# EAGLE design Adafruit S-35710 Breakout (EAGLE 9.6.2)
COMPANY: ADAFRUIT INDUSTRIES; DRAWN: KTOWN; REV: A
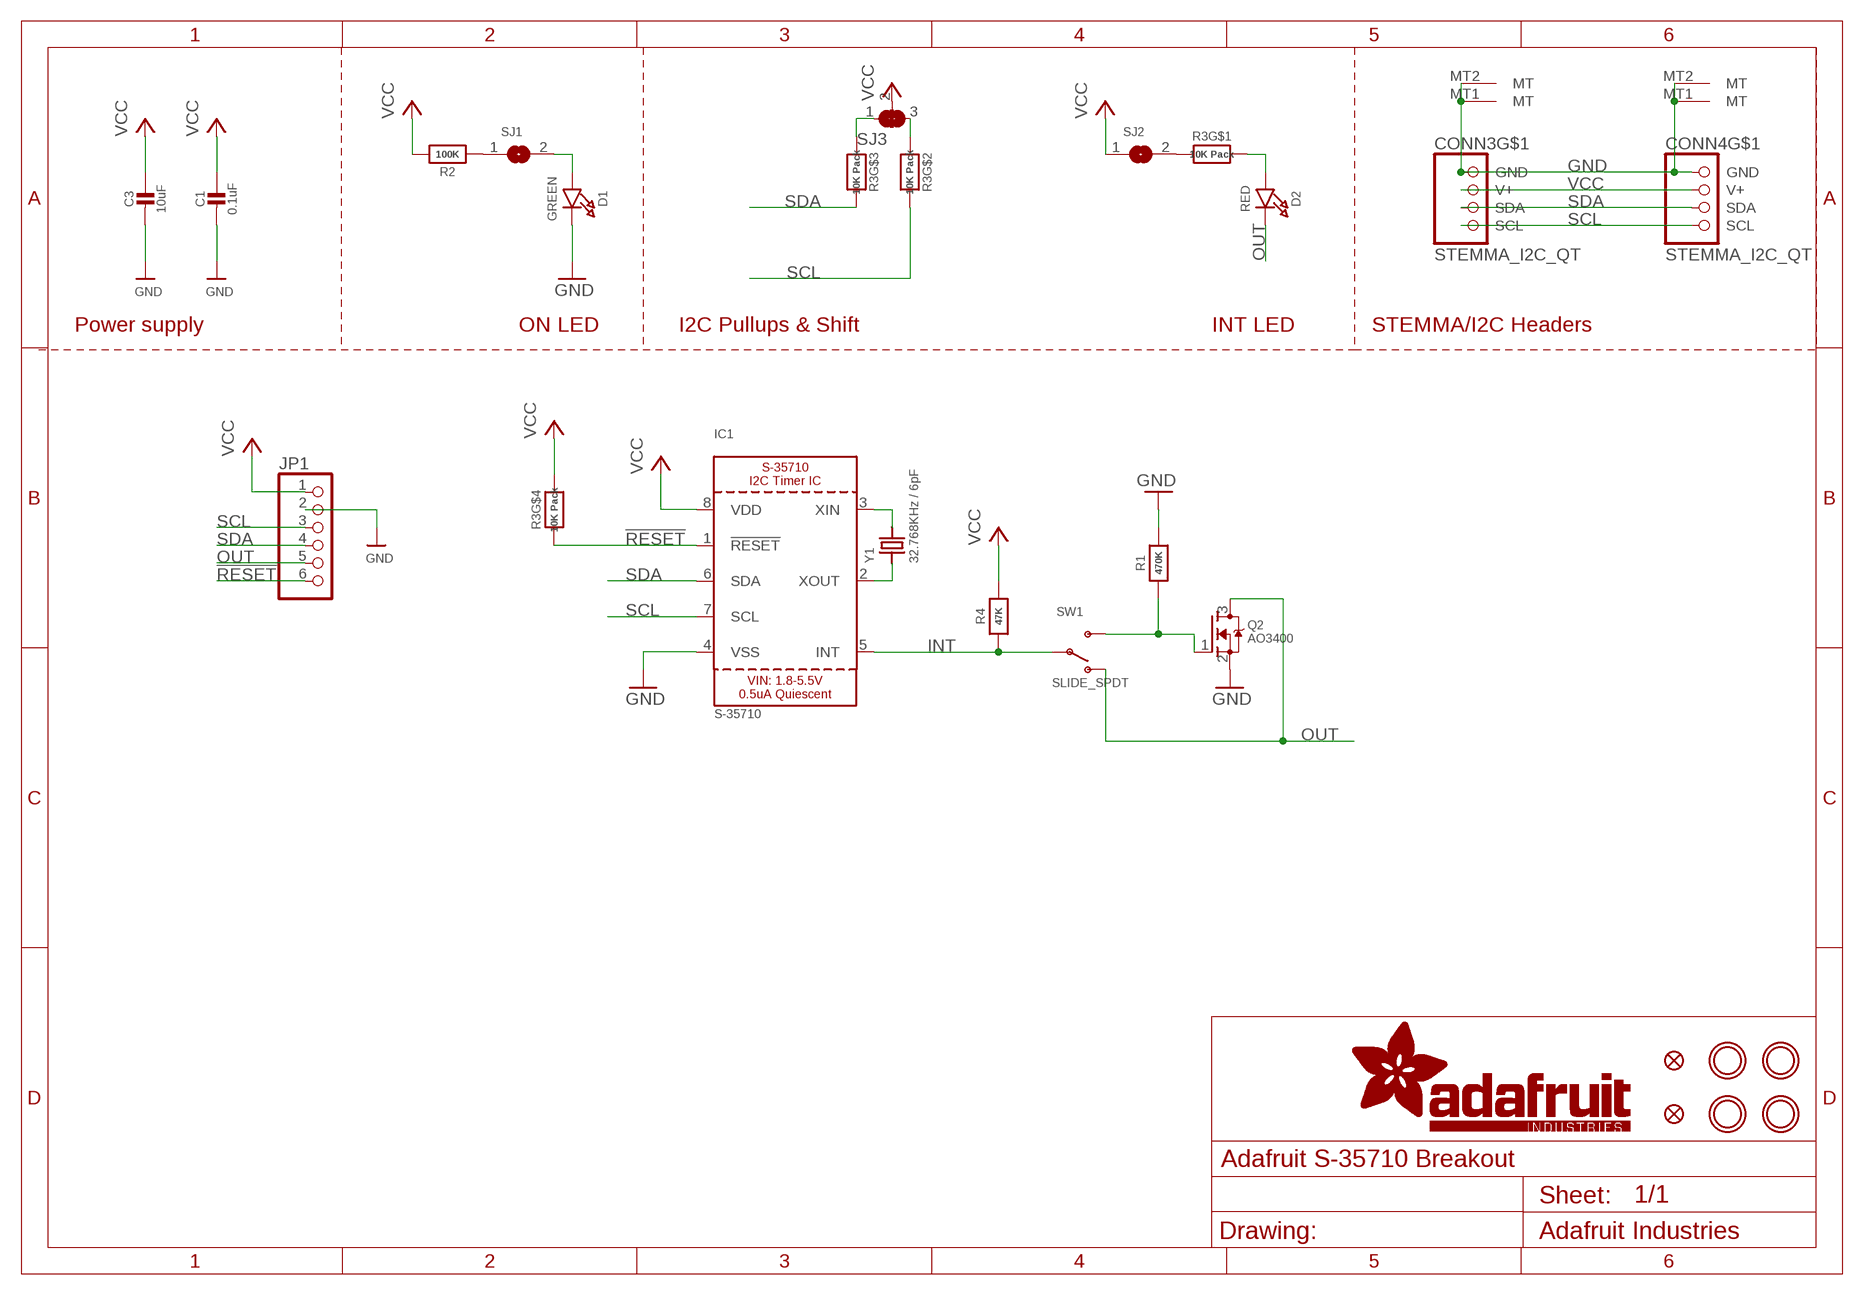
[diagram p0: schematic, sheet 1]

## Parts
C1  0.1uF  CAP_CERAMIC0603_NO  [0603-NO]
C3  10uF  CAP_CERAMIC0805-NOOUTLINE  [0805-NO]
CONN3  STEMMA_I2C_QT  [JST_SH4]
CONN4  STEMMA_I2C_QT  [JST_SH4]
D1  GREEN  LED0603_NOOUTLINE  [CHIPLED_0603_NOOUTLINE]
D2  RED  LED0603_NOOUTLINE  [CHIPLED_0603_NOOUTLINE]
FID3  FIDUCIAL_1MM  [FIDUCIAL_1MM]
FID4  FIDUCIAL_1MM  [FIDUCIAL_1MM]
IC1  S-35710  [MSOP8_0.65MM]
JP1  HEADER-1X670MIL  [1X06_ROUND_70]
Q2  AO3400  MOSFET-NWIDE  [SOT23-WIDE]
R1  470K  RESISTOR_0603_NOOUT  [0603-NO]
R2  100K  RESISTOR_0603_NOOUT  [0603-NO]
R3  10K Pack  RESISTOR_4PACK  [RESPACK_4X0603]
R4  47K  RESISTOR_0603_NOOUT  [0603-NO]
SJ1  SOLDERJUMPERCLOSED  [SOLDERJUMPER_CLOSEDWIRE]
SJ2  SOLDERJUMPERCLOSED  [SOLDERJUMPER_CLOSEDWIRE]
SJ3  SOLDERJUMPER_2WAY  [SOLDERJUMPER_2WAY_OPEN_NOPASTE]
SW1  SLIDE_SPDT  SWITCH_SPDT  [SPDT_SMT_SSSS811101]
U$1  MOUNTINGHOLE2.5  [MOUNTINGHOLE_2.5_PLATED]
U$17  MOUNTINGHOLE2.5  [MOUNTINGHOLE_2.5_PLATED]
U$19  MOUNTINGHOLE2.5  [MOUNTINGHOLE_2.5_PLATED]
U$21  MOUNTINGHOLE2.5  [MOUNTINGHOLE_2.5_PLATED]
Y1  32.768KHz / 6pF  CRYSTAL_3215  [XTAL3215]

## Nets
!RESET: IC1.1(!RESET) JP1.6 R3.4
GND [highpower]: C1.2 C3.2 CONN3.1(GND) CONN3.MT1(MT) CONN3.MT2(MT) CONN4.1(GND) CONN4.MT1(MT) CONN4.MT2(MT) D1.C IC1.4(VSS) JP1.2 Q2.2(S) R1.2
INT: IC1.5(INT) R4.1 SW1.B(P)
N$1: D1.A SJ1.2
N$2: R3.1 SJ2.2
N$3: R2.1 SJ1.1
N$4: D2.A R3.8
N$5: IC1.3(XIN) Y1.P$2
N$6: IC1.2(XOUT) Y1.P$1
N$7: R3.3 SJ3.1
N$8: Q2.1(G) R1.1 SW1.C(S)
N$9: R3.2 SJ3.3
OUT: D2.C JP1.5 Q2.3(D) SW1.A(O)
SCL: CONN3.4(SCL) CONN4.4(SCL) IC1.7(SCL) JP1.3 R3.7
SDA: CONN3.3(SDA) CONN4.3(SDA) IC1.6(SDA) JP1.4 R3.6
VCC [highpower]: C1.1 C3.1 CONN3.2(V+) CONN4.2(V+) IC1.8(VDD) JP1.1 R2.2 R3.5 R4.2 SJ2.1 SJ3.2

## Notes on the sheet
- Power supply | ON LED | I2C Pullups & Shift | INT LED | STEMMA/I2C Headers

## Library data of the parts
C1 C3 = microbuilder:CAP_CERAMIC: Ceramic Capacitors For new designs, use the packages preceded by an '_' character since they are more reliable: The following footprints should be used on most boards: _0402 - Standard footprint for regular board layouts _0603 - Standard footprint for regular board layouts _0805 - Standard footprint for regular board layouts _1206 - Standard footprint for regular board layouts For extremely tight-pitch boards where space is at a premium, the following 'micro-pitch' footprints can be used (smaller pads, no silkscreen outline, etc.): _0402MP - Micro-pitch footprint for very dense/compact boards _0603MP - Micro-pitch footprint for very dense/compact boards _0805MP - Micro-pitch footprint for very dense/compact boards _1206MP - Micro-pitch footprint for very dense/compact boards
CONN3 CONN4 = adafruit_electromech:STEMMA_I2C; LCSC: C2845363
D1 D2 = microbuilder:LED: LED 0603 - 0603 Surface Mount Package 2mA: Green LED - Low Power (3.9mcd, 2ma, 1.7Vf) - Digikey: 475-2709-2-ND Orange LED - Low Power (9.8mcd, 2ma, 1.8Vf) - Digikey: 475-1194-2-ND Red LED - Low Power (5mcd, 2ma, 1.8Vf) - Digikey: 475-1195-2-ND Yellow LED - Low Power (7mcd, 2ma, 1.8Vf) - Digikey: 475-1196-2-ND 5mA: Blue LED - Low Power (17mcd, 5ma, 2.9Vf) - Digikey: LNJ937W8CRACT-ND 0805 - 0805 Surface Mount Package 2mA: Red LED (8.8mcd, 2mA, 1.8Vf, Clear) - Low Power [Digikey: 475-2510-1-ND] Green LED (5mcd, 2mA, 1.8Vf, Clear) - Low Power [Digikey: 475-2730-1-ND] Yellow LED (11.3mcd, 2mA, 1.8Vf, Clear) - Low Power [Digikey: 475-2555-1-ND] 20mA: Red LED (104mcd, 20mA, Diffused) - LS R976 [Digikey: 475-1278-6-ND] Red LED (12mcd, 20mA, 2.0Vf, Clear) - APT2012EC [Digikey: 754-1128-1-ND] Green LED (15mcd, 20mA, 2.2Vf, Clear) - APT2012GC [Digikey: 754-1131-1-ND] Orange LED (160mcd, 20mA, 2.1Vf, Clear) - APT2012SECK [Digikey: 754-1130-1-ND] 1206 - 1206 Surface Mount Package Green LED (26mcd, 20mA, Diffused) - LG N971 [Digikey: 475-1407-6-ND] Red LED (15mcd, 20mA, Diffused) - LH N974 [Digikey: 475-1416-6-ND] Cree - Cree High-Power Surface Mount LEDs XPEBWT-L1-0000-00D50 - White 111lm 350mA 2.9Vf 6200K 110° XTEAWT-00-0000-00000LEE3 - White 114lm 350mA 2.85Vf 5000K 115° Everlight - Everlight 45-21 Series Surface Mount LEDs 45-21/QK2C-B2832AC2CB2/2T - Warm White 2000mcd 20mA 3.25Vf 3050K 120° 45-21/LK2C-B38452C4CB2/2T - Nuetral White 2000mcd 20mA 3.25Vf 4150K 120° 45-21/LK2C-B50634C6CB2/2T - Cold White 2200mcd 20mA 3.25Vf 5650K 120° PLCC2 Reverse Mount LS T77K-J1L2-1-0-2-R18-Z - Red 11.25mcd 2mA 1.8Vf 630nm 120° LO T77K-L1M2-24-Z - Orange 19.6mcd 2mA 1.8Vf 606nm 120° LY T77K-K2M1-26-Z - Yellow 15.7mcd 2mA 1.8Vf 587nm 120°; ROT: 270
FID3 FID4 = microbuilder:FIDUCIAL: Fiducial Alignment Points Various fiducial points for machine vision alignment.; BOM: EXCLUDE
IC1 = adafruit_power:S-35710
JP1 = microbuilder:HEADER-1X6: PIN HEADER
Q2 = microbuilder:MOSFET-N: N-Channel Mosfet LEGEND VDS: Voltage Drain-Source ID: Drain Current RDS(ON): Drain-Source On-State Resistance VGS(TH): Gate-Source Threshold Voltage CISS: Drain-Source Input Capacitance SOT-23 Name VDS ID RDS(ON) VGS(TH) CISS Order Number 2N7002E 60V 260mA 2.5 Ohm 2.5V @ 250uA 26.7pF @ 25V 2N7002ET1GOSTR-ND BSH103 30V 850mA 400 mOhm 400mV @ 1mA 83pF @ 24V BSH103,235-ND BSS138 60V 320mA 1.6 Ohm 1.5V @ 250uA 50pF @ 10V Mouser: 771-BSS138PW115 DMN2075U-7 20V 4.2A 38 mOhm 1V @ 250 uA 594.3pF @ 10V DMN2075U-7DICT-ND * BSS138 good choice for I2C level-shifting POWERPAK 1212-8 Name VDS ID RDS(ON) VGS(TH) CISS Order Number Si7308DN 60V 6A 58 mOhm 3V @ 250uA 665pF @ 15V SI7308DN-T1-E3CT-ND
R1 R2 R4 = microbuilder:RESISTOR: Resistors For new designs, use the packages preceded by an '_' character since they are more reliable: The following footprints should be used on most boards: _0402 - Standard footprint for regular board layouts _0603 - Standard footprint for regular board layouts _0805 - Standard footprint for regular board layouts _1206 - Standard footprint for regular board layouts For extremely tight-pitch boards where space is at a premium, the following 'micro-pitch' footprints can be used (smaller pads, no silkscreen outline, etc.): _0402MP - Micro-pitch footprint for very dense/compact boards _0603MP - Micro-pitch footprint for very dense/compact boards _0805MP - Micro-pitch footprint for very dense/compact boards _1206MP - Micro-pitch footprint for very dense/compact boards
R3 = microbuilder:RESISTOR_4PACK: Resistor Packs (4 resistors) 4 x 0603 10K 1/16W - Digikey: YC164J-10KCT-ND
SJ1 SJ2 = microbuilder:SOLDERJUMPER: SMD Solder JUMPER Solder the two pads together to create a connection, or remove the solder to break it. REFLOW - Use this footprint for solder paste and reflow ovens. WAVE - Use this footprint for hand-soldering (larger pads). CLOSED - Has a trace between the two pads to ensure it is closed by default. The trace needs to be cut to disable the jumper, and can be closed again by creating a solder bridge between the two pads.
SJ3 = microbuilder:SOLDERJUMPER_2WAY: 2-Way Solder Jumper
SW1 = adafruit_electromech:SWITCH_SPDT: Switch - SPDT SSSS811101 - Horizontal Two Position SMT, 0.3A 4V [Mouser: 688-SSSS811101]
U$1 U$17 U$19 U$21 = adafruit_electromech:MOUNTINGHOLE: Mounting Hole For #2 screws (0.086"/2.18mm width, 0.094"/2.4mm hole) use 2.5mm; BOM: EXCLUDE
Y1 = microbuilder:CRYSTAL: Crystals HC49UP - Surface Mount Crystal 4.0MHz 18pF +/-30ppm Surface Mount Crystal [Digikey: 535-9857-1-ND] 12.0 MHz Surface Mount Crystal [Digikey: 535-9869-6-ND] 25.0 MHz Surface Mount Crystal [Digikey: 535-9078-1-ND] 2.5 x 2.0mm - MEMs SMT Crystal 16.0 MHz 10pF 20ppm 2.5 x 2.0mm Crystal [Digikey -40-85°C: 535-10923-1-ND] 3.2 x 2.5mm - MEMs SMT Crystal 12.0 MHz 8pF 15ppm 3.2 x 2.5mm Crystal [Digikey: -10-70°C: 644-1047-1-ND -40-125°C: 644-1128-1-ND] 40~85°C cheaper: 644-1173-6-ND 16.0 MHz 8pF 15ppm 3.2 x 2.5mm Crystal [Digikey: -10-70°C: 644-1049-1-ND -40-125°C: 644-1129-2-ND]-40~85°C cheaper: 644-1175-6-ND 16.0 MHz 10pF 10ppm 3.2 x 2.5mm Crystal [Digikey: 644-1100-1-ND] 27.12 MHz 18pF 30ppm 3.2 x 2.5mm Crystal [Digikey: 887-1424-1-ND] 27.12MHz 10pF 10ppm 3.2 x 2.5mm Crystal [Digikey: 887-1329-1-ND] 4.9 x 1.8mm - MEMs SMT Crystal 32.768 KHz 12.5pF 20ppm 4.9 x 1.8mm Crystal [Digikey: SE2415CT-ND] 8.0 x 3.8mm - Surface Mount Crystal 32.768kHz 12.5pF 20ppm -40°C-85°C [Digikey: 535-9166-2-ND] Cylinder 32.768KHz Cylinder Crystal (2x6mm body) [Ex. Digikey: 300-8341-2-ND]

## Net classes
1 highpower: width 0.305 mm, drill 0.483 mm
2 lowpower: width 0.254 mm, drill 0.483 mm

## Board
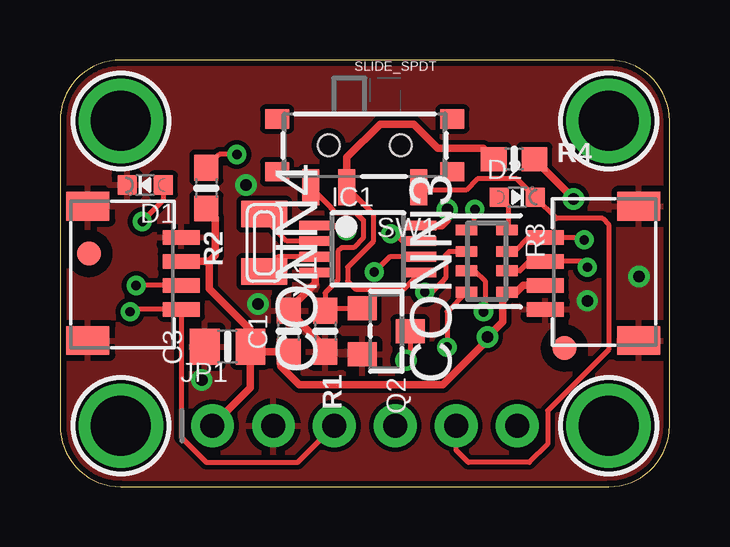
[diagram p1: board, top side]
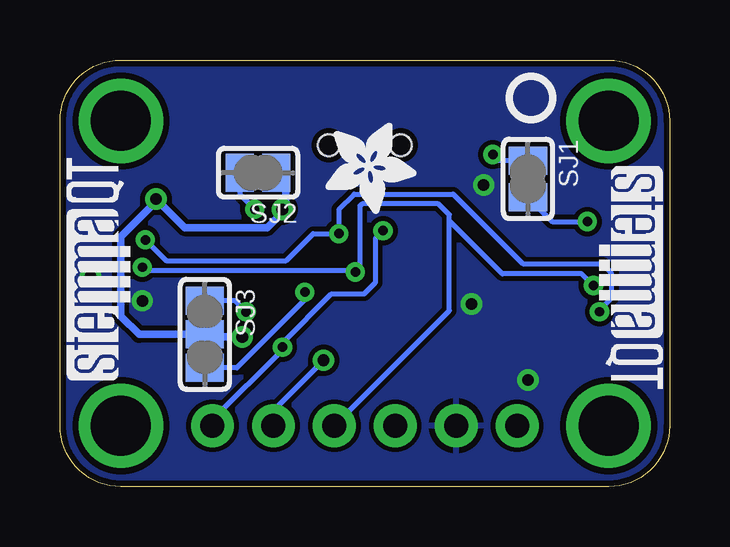
[diagram p2: board, bottom side, seen from below]

Size 25.4 x 17.78 mm. Coordinates in mm from the lower left corner, seen from the top.
Outline: 0,15.24 0,2.54 arc90 2.54,0 22.86,0 arc90 25.4,2.54 25.4,15.24 arc90 22.86,17.78 2.54,17.78 arc90 0,15.24
Copper layers (1*16): Top 0.035mm / dielectric 1.5mm / Bottom 0.035mm
Design rules "adafruit *": minimum track width 8mil, minimum drill 15.5mil, track to track 8mil, track to pad 8mil, pad to pad 8mil, via to via 8mil, smd to smd 8mil, copper to edge 10mil, drill to drill 8mil, minimum pad ring 10mil, minimum via ring 8mil, stop-mask expansion 2mil, vias tented up to drill 20mil, thermal gap 10mil

### Footprints (pad centres in the part's own frame; a part is rotated, then mirrored left to right if it is on the bottom)
0603-NO = smd 1.075 x 1: 1 -0.85,0; 2 0.85,0
0805-NO = smd 1.24 x 1.5: 1 -0.95,0; 2 0.95,0
JST_SH4 = smd 0.6 x 1.55: 1 -1.5,2.006; 2 -0.5,2.006; 3 0.5,2.006; 4 1.5,2.006 | smd 1.2 x 1.8: MT1 -2.8,-1.894; MT2 2.8,-1.894
CHIPLED_0603_NOOUTLINE = smd 0.8 x 0.8: A 0,-0.75; C 0,0.75
FIDUCIAL_1MM = smd 1 x 1: 1 0,0
MSOP8_0.65MM = smd 0.4 x 1.3: 1 -0.975,-2.2; 2 -0.325,-2.2; 3 0.325,-2.2; 4 0.975,-2.2; 5 0.975,2.2; 6 0.325,2.2; 7 -0.325,2.2; 8 -0.975,2.2
1X06_ROUND_70 = drill 1 pad 1.778: 1 -6.35,0; 2 -3.81,0; 3 -1.27,0; 4 1.27,0; 5 3.81,0; 6 6.35,0
SOT23-WIDE = smd 1 x 1.2: 1 -0.95,-1; 2 0.95,-1; 3 0,1
RESPACK_4X0603 = smd 0.45 x 0.9: 1 -1.3,-0.85; 2 -0.4,-0.85; 3 0.4,-0.85; 4 1.3,-0.85; 5 1.3,0.85; 6 0.4,0.85; 7 -0.4,0.85; 8 -1.3,0.85
SOLDERJUMPER_CLOSEDWIRE = smd 1.168 x 1.6: 1 -0.762,0; 2 0.762,0 | smd 0.635 x 0.203: WIRE 0,0
SOLDERJUMPER_2WAY_OPEN_NOPASTE = smd 1.168 x 1.6: 1 -1.397,0; 2 0,0; 3 1.397,0
SPDT_SMT_SSSS811101 = smd 0.7 x 1.5: A -2.25,1.242; B 0.75,1.242; C 2.25,1.242 | smd 1 x 0.8: SUP1 -3.65,0.592; SUP2 -3.65,-1.608; SUP3 3.65,0.592; SUP4 3.65,-1.608 | hole 0.9: -1.5,-0.508; 1.5,-0.508
MOUNTINGHOLE_2.5_PLATED = drill 2.5 pad 3.2: P$1 0,0
XTAL3215 = smd 1.1 x 1.9: P$1 1.2,0; P$2 -1.2,0

### Placement (x,y rotation side)
C1  9.53,6.48 90 top
C3  6.99,5.84 180 top
CONN3  22.23,8.89 90 top
CONN4  3.05,8.89 270 top
D1  3.56,12.57 90 top
D2  19.05,12.06 270 top
FID3  1.21,9.72 0 top
FID4  21.02,5.78 0 top
IC1  12.83,9.91 270 top
JP1  12.7,2.54 0 top
PLABEL0  [PLABEL0]  6.35,0.89 0 top
PLABEL1  [PLABEL1]  19.05,4.19 0 top
PLABEL2  [PLABEL2]  9.02,4.06 0 top
PLABEL3  [PLABEL3]  11.56,0.89 0 top
PLABEL4  [PLABEL4]  14.1,4.06 0 top
PLABEL5  [PLABEL5]  16.76,0.89 0 top
PLABEL6  [PLABEL6]  12.7,16.83 0 top
PLABEL7  [PLABEL7]  0.38,12.45 0 top
PLABEL8  [PLABEL8]  20.38,12.19 0 top
PLABEL9  [PLABEL9]  18.8,14.92 0 top
PLABEL10  [PLABEL10]  6.73,14.99 0 top
PLABEL11  [PLABEL11]  13.34,16.32 0 bottom
PLABEL13  [PLABEL13]  12.83,0.89 0 bottom
PLABEL14  [PLABEL14]  4.19,12.57 90 bottom
PLABEL15  [PLABEL15]  19.68,13.21 90 bottom
PLABEL16  [PLABEL16]  10.73,8.51 0 bottom
PLABEL17  [PLABEL17]  10.73,5.52 0 bottom
PLABEL18  [PLABEL18]  12.89,10.48 0 bottom
PLABEL19  [PLABEL19]  21.27,6.41 90 bottom
Q2  13.59,6.48 270 top
R1  11.05,6.48 270 top
R2  6.1,12.45 270 top
R3  17.78,9.4 270 top
R4  18.92,13.65 0 top
SJ1  5.91,12.83 270 bottom
SJ2  17.14,13.08 180 bottom
SJ3  19.37,6.35 270 bottom
SW1  12.7,13.72 180 top
U$1  2.54,15.24 0 top
U$17  22.86,15.24 0 top
U$19  2.54,2.54 0 top
U$21  22.86,2.54 0 top
U$22  [ADAFRUIT_3.5MM]  14.35,15.18 270 bottom
U$25  [PCBFEAT-REV-040]  5.78,16.19 0 bottom
U$30  [STEMMAQT]  22.48,4.45 90 bottom
U$31  [STEMMAQT]  2.92,13.34 270 bottom
Y1  8.51,10.16 90 top

### Tracks (layer width: path | path; a pad name or v marks a point on that pad's centre or on a via)
!RESET  (via drill 0.39)
  Top 0.203: IC1.1 11.47,10.88 11.62,10.73 11.87,10.73 v11.94,10.67 | R3.4 16.13,7.3 v16.13,5.82
  Bottom 0.203: JP1.6 19.05,2.79 16.13,5.71 v16.13,5.82 16.13,6.01 14.1,8.04 12.72,8.04 12.26,8.51 12.26,10.35 v11.94,10.67
GND  (via drill 0.48)
  Top 0.305: IC1.4 10.63,8.47 9.53,7.37 C1.2 10.19,6.66 10.19,6.64 11.05,5.79 R1.2
  other vias: 5.91,4.45 8.26,7.62 24.13,8.76 21.97,7.75 7.75,12.57
  pour Top: 0,17.78 25.4,17.78 25.4,0 0,0
  pour Bottom: 0,17.78 25.4,17.78 25.4,0 0,0
INT
  Top 0.203: SW1.B 13.05,11.38 13.05,10.21 11.99,9.15 11.99,8.56 12.32,8.23 14.33,8.23 IC1.5
  Top 0.305: SW1.B 11.95,13.73 13.34,15.11 14.73,15.11 15.75,14.1 17.63,14.1 R4.1
N$1  (via drill 0.39)
  Top 0.203: D1.A 4.31,11.94 v3.43,11.06 v3.43,11.05
  Bottom 0.203: SJ1.2 4.89,11.05 v3.43,11.05
N$2  (via drill 0.39)
  Top 0.203: R3.1 17.25,11.02 17.25,11.56 v17.29,11.56
  Bottom 0.203: SJ2.2 17.91,12.18 v17.29,11.56
N$3  (via drill 0.39)
  Top 0.203: v7.37,13.84 6.64,13.84 R2.1
  Bottom 0.203: SJ1.1 7.11,13.59 v7.37,13.84
N$4
  Top 0.203: R3.8 18.68,10.75 18.68,11.68 D2.A
N$5
  Top 0.203: IC1.3 9.07,9.58 8.51,9.02 Y1.P$2
N$6
  Top 0.203: IC1.2 9.45,10.23 8.51,11.18 Y1.P$1
N$7  (via drill 0.39)
  Top 0.203: R3.3 17.29,9 17.72,8.57 17.72,7.36 v17.65,7.29
  Bottom 0.203: v17.65,7.29 18.11,7.75 SJ3.1
N$8
  Top 0.203: SW1.C 11.29,11.63 11.29,11.6 11.47,11.42 12.33,11.42 12.64,11.11 12.64,10.38 12.23,9.96 11.74,9.96 11.58,9.8 11.58,8.61 11.05,8.07 R1.1 11.15,7.43 Q2.1
N$9  (via drill 0.39)
  Top 0.203: R3.2 16.21,9.8 16.07,9.65 16.07,8.7 15.98,8.62 15.98,8.61 15.48,8.11 v15.2,8.11
  Bottom 0.203: SJ3.3 18.03,4.95 15.2,7.79 v15.2,8.11
N$10
  Bottom 0.152: 19.43,7.37 19.43,6.86
N$11
  Bottom 0.152: 19.37,5.84 19.37,5.4
OUT  (via drill 0.48)
  Top 0.203: JP1.5 16.51,1.52 17.02,1.02 19.56,1.02 20.32,1.78 20.32,3.17 22.86,5.71 22.86,10.92 22.61,11.18 20.69,11.18 D2.C 19.04,12.83 17.39,12.83 16.92,12.36 15.07,12.36 SW1.A | Q2.3 14.59,5.27 v14.41,5.27
  Bottom 0.203: v14.41,5.27 16.51,3.17 JP1.5
SCL  (via drill 0.39)
  Top 0.203: R3.7 18.94,9.8 19.56,10.41 20.2,10.41 CONN3.4 21.74,10.39 v21.84,10.29 | IC1.7 14.28,10.23 13.97,10.54 v13.78,10.54 | v2.92,7.29 3.02,7.39 CONN4.4 5.05,2.06 6.1,1.02 9.91,1.02 JP1.3
  Bottom 0.203: v21.84,10.29 20.98,9.42 15.98,9.42 14.86,10.54 v13.78,10.54 13.78,11.56 13.14,12.2 9.02,12.2 6.1,9.27 2.79,9.27 2.41,8.89 2.41,7.87 2.92,7.37 v2.92,7.29
SDA  (via drill 0.39)
  Top 0.203: IC1.6 13.73,9.58 v13.09,8.94 | v21.97,9.14 21.73,9.39 CONN3.3 19.55,9.39 19.16,9 R3.6 | CONN4.3 3.18,8.39 v3.17,8.38
  Bottom 0.203: v21.97,9.14 21.84,9.02 13.17,9.02 v13.09,8.94 12.9,9.13 12.9,11.69 12.81,11.79 9.63,11.79 9.18,11.33 9.18,11.08 | v3.17,8.38 3.66,8.87 6.96,8.87 9.18,11.08 | JP1.4 9.18,7.33 9.18,11.08
VCC  (via drill 0.48)
  Top 0.305: C1.1 9.21,5.63 | 9.21,5.63 8.15,5.63 C3.1 | C3.1 7.93,4.12 JP1.1 | CONN3.2 19.31,8.39 19.02,8.1 R3.5 18.45,8.1 18.45,6.87 17.83,6.24 v17.81,6.24 17.68,6.12 17.68,5.99 15.95,4.25 9.97,4.25 9.21,5.02 9.21,5.63 | v16.14,11.56 16.14,11.11 15.91,10.88 IC1.8 | CONN4.2 6.1,9.39 6.16,9.34 | 6.16,9.34 6.22,9.27 6.22,8.26 7.93,6.54 C3.1 | R2.2 6.48,11.21 6.48,9.65 6.16,9.34 | v21.4,11.99 19.77,13.62 R4.2
  Bottom 0.305: SJ2.1 16,12.7 16,11.69 v16.14,11.56 16.14,11.42 16.76,10.79 20.21,10.79 21.34,11.93 | v21.4,11.99 21.34,11.93 | v17.81,6.24 19.26,6.24 SJ3.2 22.1,6.35 22.86,7.11 22.86,10.41 21.34,11.93

### Text on the board
Pinguin_tBackup: S-35710 Timer | INV | NOR | on | out | GND | SDA | !RST | VIN | SCL | OUT
Pinguin_bBackup: S-35710 | LED | LED | 16-bit I2C Timer | Select normal / or inverted | 16-bit I2C Timer / Select normal/inverted / Open-drain output | Pullups | open-drain output | VLogic/Vcc: 3-5VDC